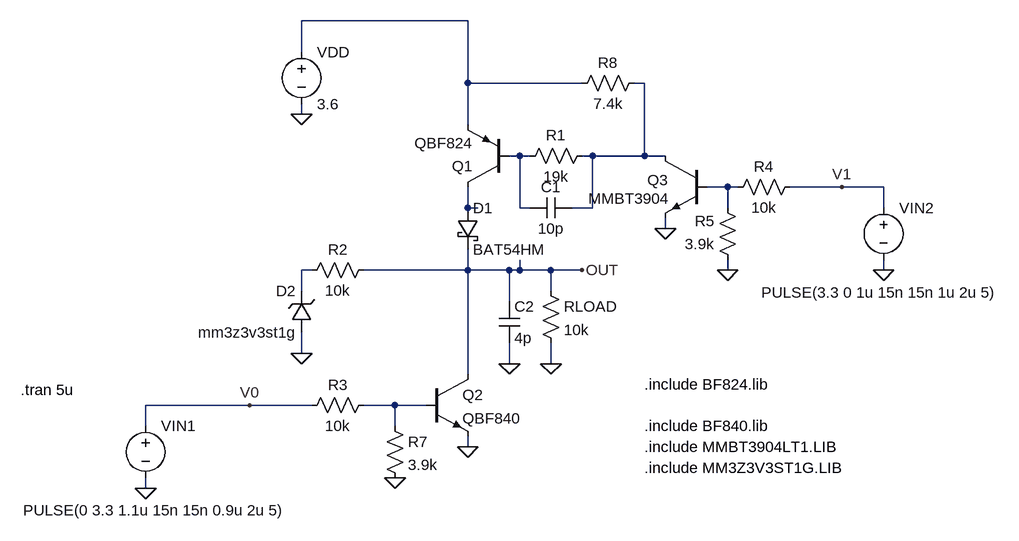
[diagram p0: schematic driver.asc]
driver.asc, the LTspice schematic file:
Version 4
SHEET 1 1112 708
WIRE 160 -64 -96 -64
WIRE -96 -16 -96 -64
WIRE 160 32 160 -64
WIRE 336 32 160 32
WIRE 432 32 416 32
WIRE -96 80 -96 64
WIRE 160 96 160 32
WIRE 240 144 224 144
WIRE 256 144 240 144
WIRE 352 144 336 144
WIRE 432 144 432 32
WIRE 432 144 352 144
WIRE 464 144 432 144
WIRE 560 192 528 192
WIRE 576 192 560 192
WIRE 736 192 656 192
WIRE 800 192 736 192
WIRE 160 224 160 192
WIRE 176 224 160 224
WIRE 240 224 240 144
WIRE 256 224 240 224
WIRE 352 224 352 144
WIRE 352 224 320 224
WIRE 560 224 560 192
WIRE 800 224 800 192
WIRE 464 256 464 240
WIRE -80 320 -96 320
WIRE 160 320 160 288
WIRE 160 320 0 320
WIRE 224 320 160 320
WIRE 240 320 240 304
WIRE 240 320 224 320
WIRE 288 320 240 320
WIRE 336 320 288 320
WIRE 560 320 560 304
WIRE 800 320 800 304
WIRE -96 352 -96 320
WIRE 288 352 288 320
WIRE 224 368 224 320
WIRE -96 448 -96 416
WIRE 224 464 224 432
WIRE 288 464 288 432
WIRE 160 480 160 320
WIRE -176 528 -336 528
WIRE -80 528 -176 528
WIRE 48 528 0 528
WIRE 96 528 48 528
WIRE -336 560 -336 528
WIRE 48 560 48 528
WIRE 160 592 160 576
WIRE -336 656 -336 640
FLAG -96 80 0
FLAG -96 448 0
FLAG 336 320 OUT
FLAG 160 592 0
FLAG -336 656 0
FLAG 464 256 0
FLAG 560 320 0
FLAG 800 320 0
FLAG 736 192 V1
FLAG -176 528 V0
FLAG 288 464 0
FLAG 48 640 0
FLAG 224 464 0
SYMBOL pnp 224 192 R180
SYMATTR InstName Q1
SYMATTR Value QBF824
SYMBOL res 352 128 R90
WINDOW 0 0 56 VBottom 2
WINDOW 3 32 56 VTop 2
SYMATTR InstName R1
SYMATTR Value 19k
SYMBOL voltage -96 -32 R0
WINDOW 123 0 0 Left 2
WINDOW 39 0 0 Left 2
SYMATTR InstName VDD
SYMATTR Value 3.6
SYMBOL schottky 144 224 R0
SYMATTR InstName D1
SYMATTR Value BAT54HM
SYMBOL res 16 304 R90
WINDOW 0 0 56 VBottom 2
WINDOW 3 32 56 VTop 2
SYMATTR InstName R2
SYMATTR Value 10k
SYMBOL zener -80 416 R180
WINDOW 0 24 64 Left 2
WINDOW 3 24 0 Left 2
SYMATTR InstName D2
SYMATTR Value mm3z3v3st1g
SYMATTR Prefix X
SYMBOL npn 96 480 R0
SYMATTR InstName Q2
SYMATTR Value QBF840
SYMBOL res 16 512 R90
WINDOW 0 0 56 VBottom 2
WINDOW 3 32 56 VTop 2
SYMATTR InstName R3
SYMATTR Value 10k
SYMBOL voltage -336 544 R0
WINDOW 3 -188 146 Left 2
WINDOW 123 0 0 Left 2
WINDOW 39 0 0 Left 2
SYMATTR Value PULSE(0 3.3 1.1u 15n 15n 0.9u 2u 5)
SYMATTR InstName VIN1
SYMBOL npn 528 144 M0
WINDOW 0 59 37 Left 2
WINDOW 3 57 66 Left 2
SYMATTR InstName Q3
SYMATTR Value MMBT3904
SYMBOL res 672 176 R90
WINDOW 0 0 56 VBottom 2
WINDOW 3 32 56 VTop 2
SYMATTR InstName R4
SYMATTR Value 10k
SYMBOL res 576 320 R180
WINDOW 0 36 76 Left 2
WINDOW 3 36 40 Left 2
SYMATTR InstName R5
SYMATTR Value 3.9k
SYMBOL voltage 800 208 R0
WINDOW 3 -188 146 Left 2
WINDOW 123 0 0 Left 2
WINDOW 39 0 0 Left 2
SYMATTR Value PULSE(3.3 0 1u 15n 15n 1u 2u 5)
SYMATTR InstName VIN2
SYMBOL res 272 336 R0
SYMATTR InstName RLOAD
SYMATTR Value 10k
SYMBOL cap 320 208 R90
WINDOW 0 0 32 VBottom 2
WINDOW 3 32 32 VTop 2
SYMATTR InstName C1
SYMATTR Value 10p
SYMBOL res 32 544 R0
SYMATTR InstName R7
SYMATTR Value 3.9k
SYMBOL cap 208 368 R0
SYMATTR InstName C2
SYMATTR Value 4p
SYMBOL res 432 16 R90
WINDOW 0 0 56 VBottom 2
WINDOW 3 32 56 VTop 2
SYMATTR InstName R8
SYMATTR Value 7.4k
TEXT -528 504 Left 2 !.tran 5u
TEXT 432 496 Left 2 !.include BF824.lib
TEXT 432 560 Left 2 !.include BF840.lib
TEXT 432 592 Left 2 !.include MMBT3904LT1.LIB
TEXT 432 624 Left 2 !.include MM3Z3V3ST1G.LIB

The netlist it stands for:
* driver.asc
Q1 N005 N003 N001 0 QBF824
R1 N002 N003 19k
VDD N001 0 3.6
D1 N005 OUT BAT54HM
R2 OUT N006 10k
XD2 0 N006 mm3z3v3st1g  ; pins + -
Q2 OUT N007 0 0 QBF840
R3 N007 V0 10k
VIN1 V0 0 PULSE(0 3.3 1.1u 15n 15n 0.9u 2u 5)
Q3 N002 N004 0 0 MMBT3904
R4 V1 N004 10k
R5 0 N004 3.9k
VIN2 V1 0 PULSE(3.3 0 1u 15n 15n 1u 2u 5)
RLOAD OUT 0 10k
C1 N002 N003 10p
R7 N007 0 3.9k
C2 OUT 0 4p
R8 N002 N001 7.4k
.model D D
.lib standard.dio
.model NPN NPN
.model PNP PNP
.lib standard.bjt
.tran 5u
.include BF824.lib
.include BF840.lib
.include MMBT3904LT1.LIB
.include MM3Z3V3ST1G.LIB
.backanno
.end